# EAGLE design controller_left_upper (EAGLE 7.6.0)
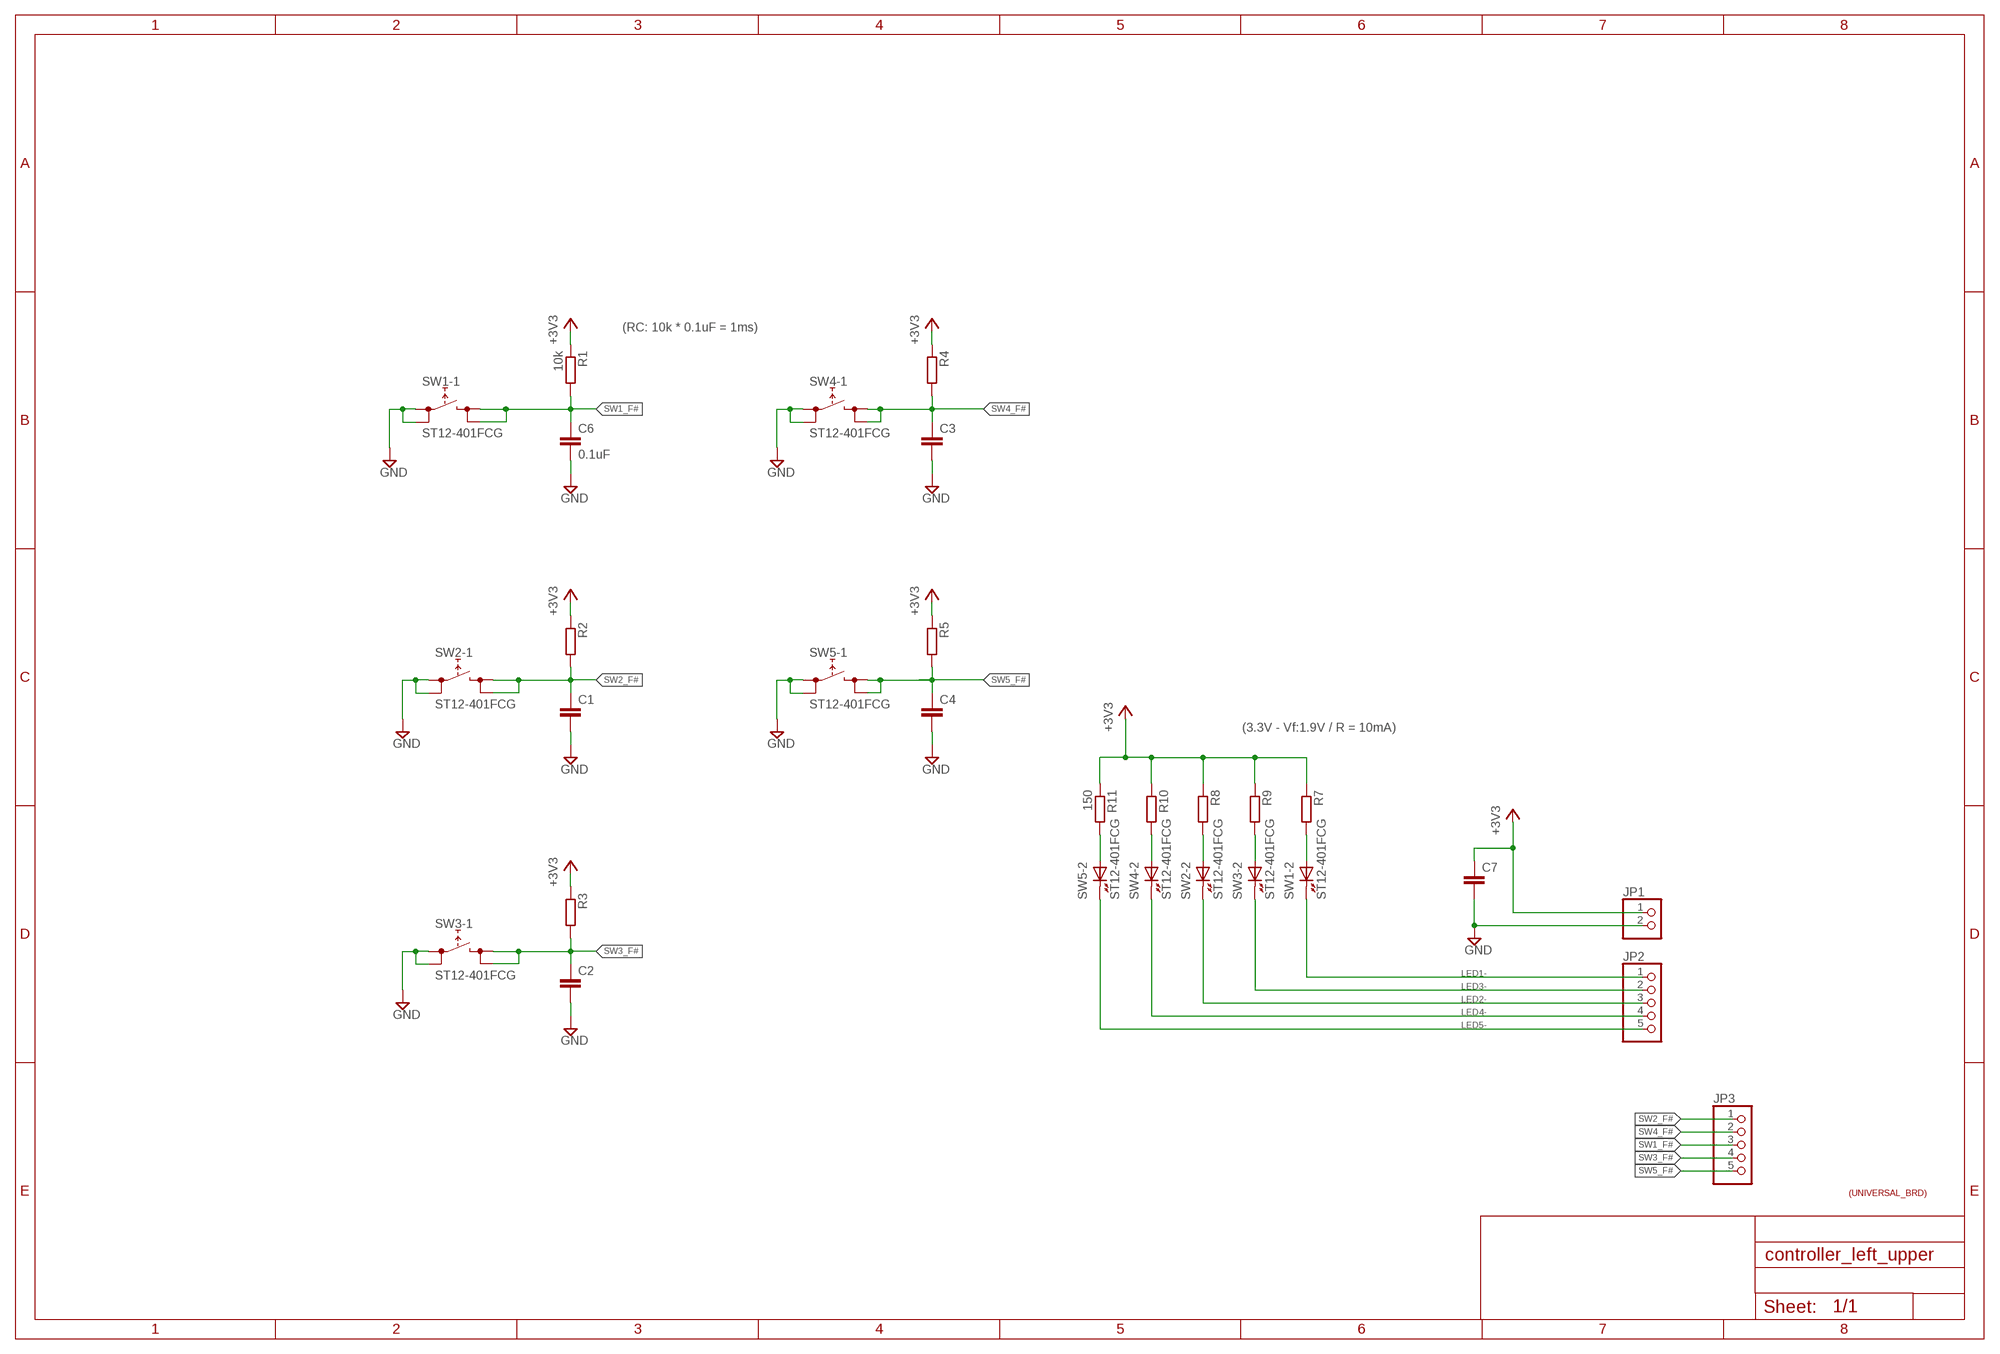
[diagram p0: schematic, sheet 1]

## Parts
C1  C_DIP_2.54_1  [C_DIP2.54_1]
C2  C_DIP_2.54_1  [C_DIP2.54_1]
C3  C_DIP_2.54_1  [C_DIP2.54_1]
C4  C_DIP_2.54_1  [C_DIP2.54_1]
C6  0.1uF  C_DIP_2.54_1  [C_DIP2.54_1]
C7  C_DIP_2.54_1  [C_DIP2.54_1]
JP1  PINHD-1X2  [1X02]
JP2  PINHD-1X5  [1X05]
JP3  PINHD-1X5  [1X05]
R1  10k  R_DIP_4  [R_DIP2.54_4]
R2  R_DIP_4  [R_DIP2.54_4]
R3  R_DIP_4  [R_DIP2.54_4]
R4  R_DIP_4  [R_DIP2.54_4]
R5  R_DIP_4  [R_DIP2.54_4]
R7  R_DIP_4  [R_DIP2.54_4]
R8  R_DIP_4  [R_DIP2.54_4]
R9  R_DIP_4  [R_DIP2.54_4]
R10  R_DIP_4  [R_DIP2.54_4]
R11  150  R_DIP_4  [R_DIP2.54_4]
SW1  ST12-401FCG  [ST12-401FCG]
SW2  ST12-401FCG  [ST12-401FCG]
SW3  ST12-401FCG  [ST12-401FCG]
SW4  ST12-401FCG  [ST12-401FCG]
SW5  ST12-401FCG  [ST12-401FCG]
U$1  UNIVERSAL_BRD_95MM_72MM  [UNIVERSAL_BRD_95MM_72MM]

## Nets
+3V3: C7.1 JP1.1 R1.1 R2.1 R3.1 R4.1 R5.1 R7.1 R8.1 R9.1 R10.1 R11.1
GND: C1.2 C2.2 C3.2 C4.2 C6.2 C7.2 JP1.2 SW1.1 SW1.2 SW2.1 SW2.2 SW3.1 SW3.2 SW4.1 SW4.2 SW5.1 SW5.2
LED1-: JP2.1 SW1.-(-2:K)
LED2-: JP2.3 SW2.-(-2:K)
LED3-: JP2.2 SW3.-(-2:K)
LED4-: JP2.4 SW4.-(-2:K)
LED5-: JP2.5 SW5.-(-2:K)
N$2: R9.2 SW3.+(-2:A)
N$7: R8.2 SW2.+(-2:A)
N$13: R10.2 SW4.+(-2:A)
N$21: R11.2 SW5.+(-2:A)
N$29: R7.2 SW1.+(-2:A)
SW1_F#: C6.1 JP3.3 R1.2 SW1.3 SW1.4
SW2_F#: C1.1 JP3.1 R2.2 SW2.3 SW2.4
SW3_F#: C2.1 JP3.4 R3.2 SW3.3 SW3.4
SW4_F#: C3.1 JP3.2 R4.2 SW4.3 SW4.4
SW5_F#: C4.1 JP3.5 R5.2 SW5.3 SW5.4

## Notes on the sheet
- (RC: 10k * 0.1uF = 1ms)
- (3.3V - Vf:1.9V / R = 10mA)

## Library data of the parts
C1-C4 C6 C7 = shozaburo_rcl:C: s means small package
JP1 = shozaburo_pinhead:PINHD-1X2: PIN HEADER
JP2 JP3 = shozaburo_pinhead:PINHD-1X5: PIN HEADER
R1-R5 R7-R11 = shozaburo_rcl:R
SW1-SW5 = shozaburo_switch:ST12-401FCG
U$1 = shozaburo_brd_template:UNIVERSAL_BRD_95MM_72MM

## Board
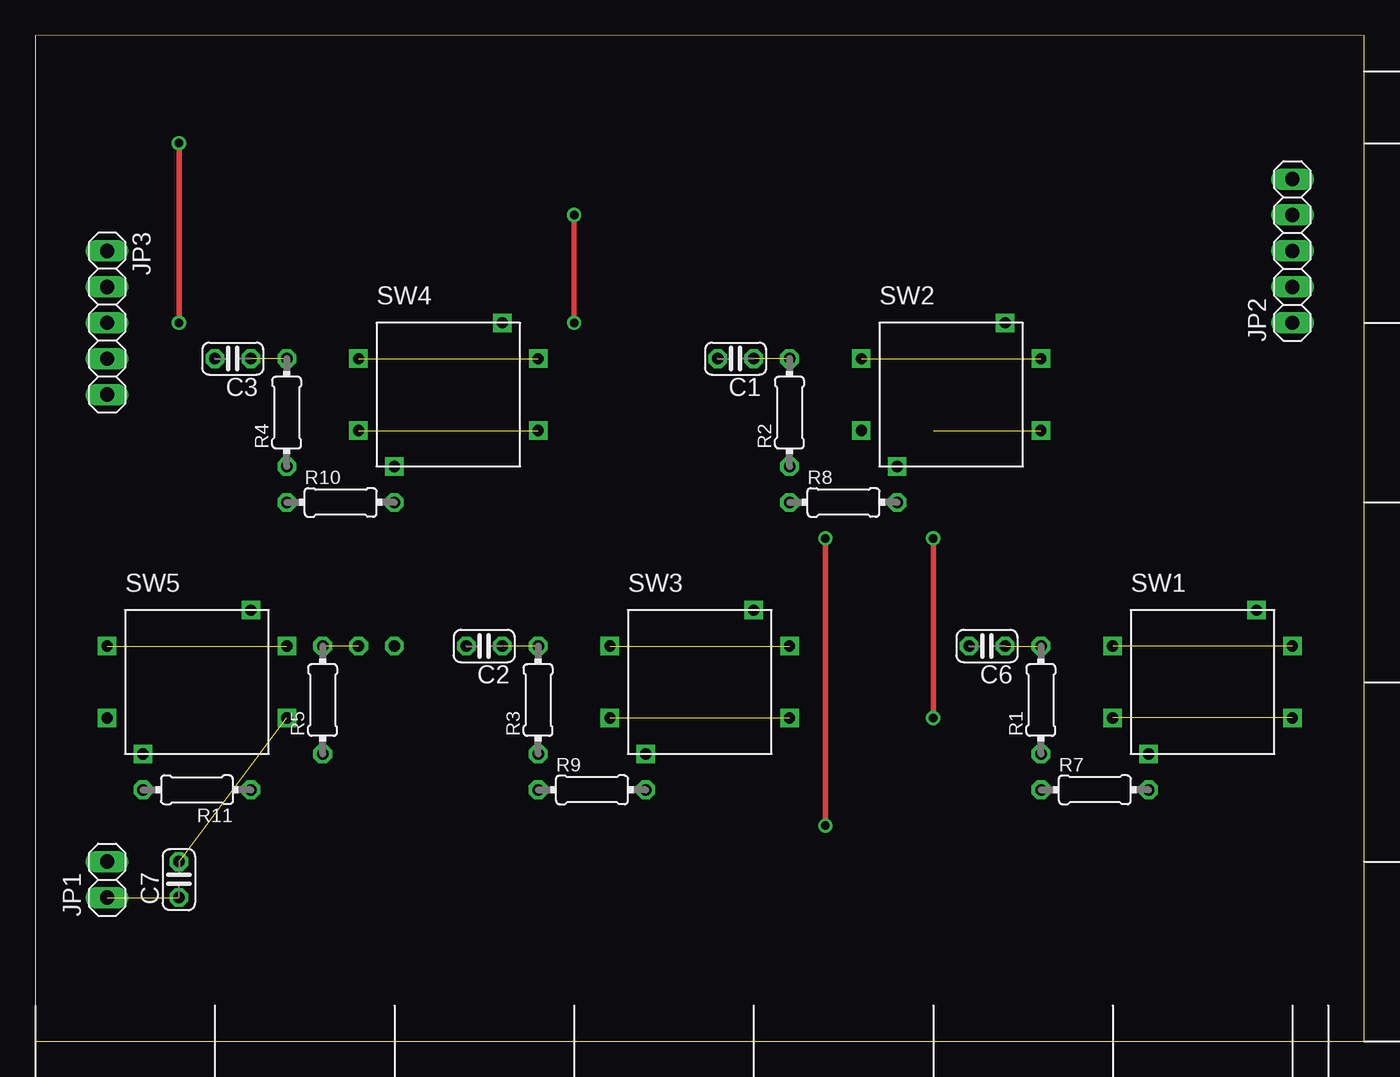
[diagram p1: board, top side]
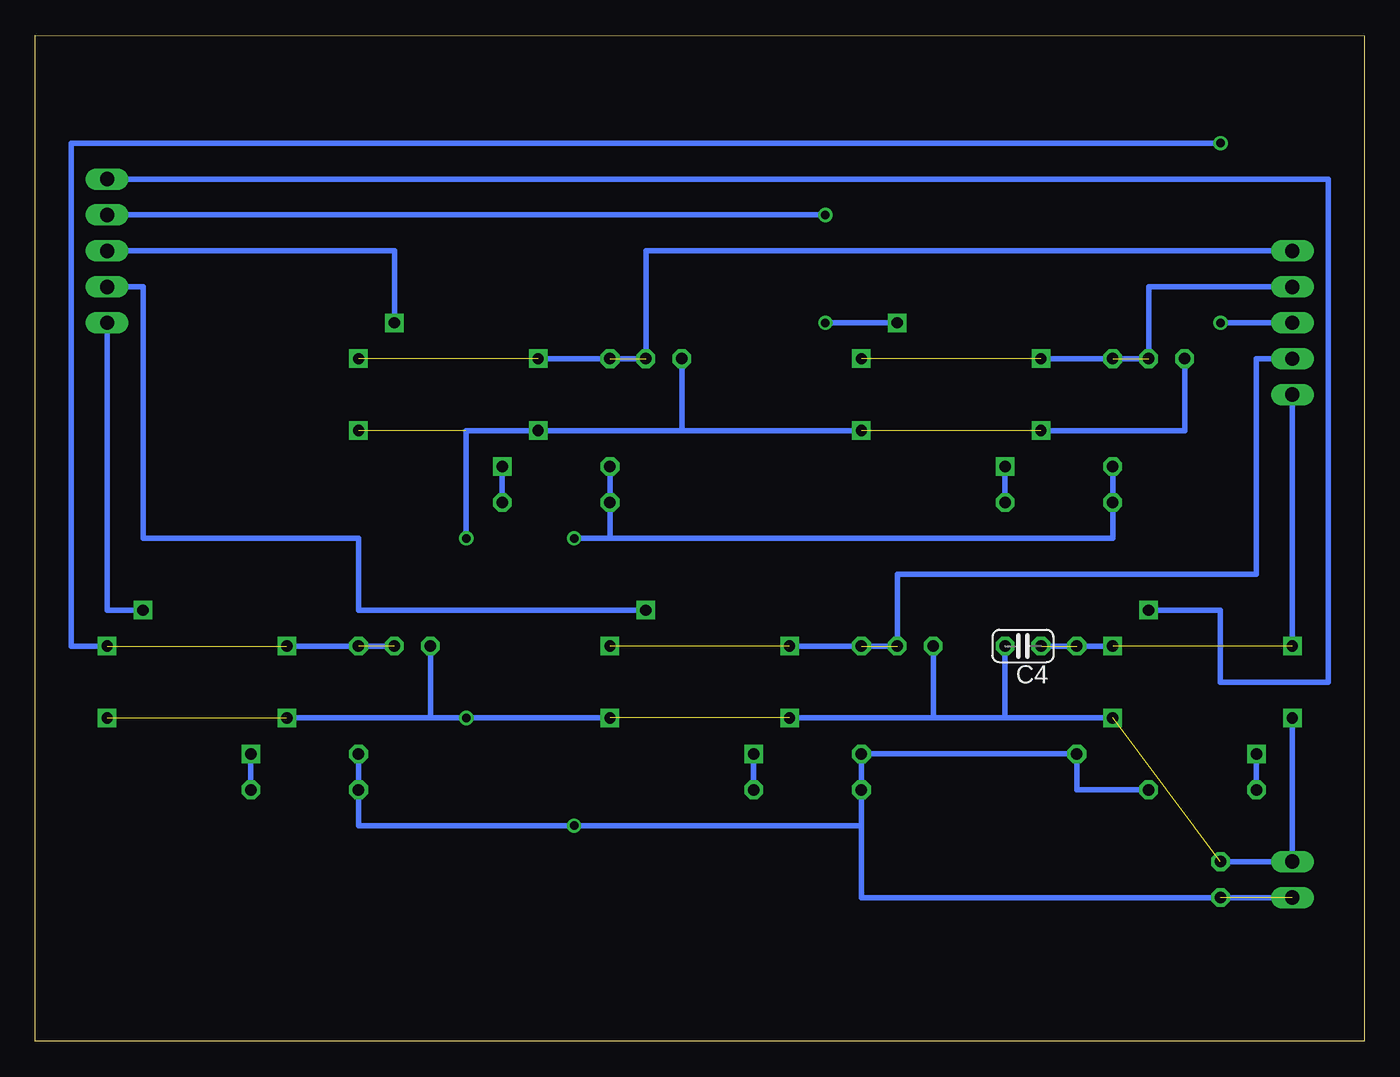
[diagram p2: board, bottom side, seen from below]

Size 93.98 x 71.12 mm. Coordinates in mm from the lower left corner, seen from the top.
Outline: 0,0 93.98,0 93.98,71.12 0,71.11 0,0
Copper layers (1*16): Top 0.035mm / dielectric 1.5mm / Bottom 0.035mm
Design rules "default": minimum track width 10mil, minimum drill 24mil, track to track 8mil, track to pad 8mil, pad to pad 8mil, via to via 8mil, smd to smd 8mil, copper to edge 40mil, drill to drill 8mil, minimum pad ring 10mil, minimum via ring 8mil, stop-mask expansion 4mil, vias tented up to drill 0mil, thermal gap 10mil

### Footprints (pad centres in the part's own frame; a part is rotated, then mirrored left to right if it is on the bottom)
C_DIP2.54_1 = drill 0.813 octagon: 1 -1.27,0; 2 1.27,0
1X02 = drill 1.016 long: 1 -1.27,0; 2 1.27,0
1X05 = drill 1.016 long: 1 -5.08,0; 2 -2.54,0; 3 0,0; 4 2.54,0; 5 5.08,0
R_DIP2.54_4 = drill 0.813 octagon: 1 -3.81,0; 2 3.81,0
ST12-401FCG = drill 0.8 square: 1 -5.08,-2.54; 2 7.62,-2.54; 3 -5.08,2.54; 4 7.62,2.54; + -2.54,-5.08; - 5.08,5.08

### Placement (x,y rotation side)
C1  49.53,48.26 180 top
C2  31.75,27.94 180 top
C3  13.97,48.26 180 top
C4  24.13,27.94 180 bottom
C6  67.31,27.94 180 top
C7  10.16,11.43 90 top
JP1  5.08,11.43 90 top
JP2  88.9,55.88 90 top
JP3  5.08,50.8 270 top
R1  71.12,24.13 90 top
R2  53.34,44.45 90 top
R3  35.56,24.13 90 top
R4  17.78,44.45 90 top
R5  20.32,24.13 90 top
R7  74.93,17.78 0 top
R8  57.15,38.1 0 top
R9  39.37,17.78 0 top
R10  21.59,38.1 0 top
R11  11.43,17.78 180 top
SW1  81.28,25.4 0 top
SW2  63.5,45.72 0 top
SW3  45.72,25.4 0 top
SW4  27.94,45.72 0 top
SW5  10.16,25.4 0 top
U$1  0,0 0 top

### Tracks (layer width: path | path; a pad name or v marks a point on that pad's centre or on a via)
+3V3  (via drill 0.6)  (1 unrouted)
  Top 0.406: v55.88,35.56 v55.88,15.24
  Bottom 0.406: R4.1 R10.1 17.78,35.56 53.34,35.56 | R2.1 R8.1 53.34,35.56 | R11.1 20.32,17.78 R5.1 R3.1 R9.1 35.56,15.24 | R7.1 R1.1 71.12,15.24 v55.88,15.24 35.56,15.24 | JP1.1 35.56,10.16 35.56,15.24 | 53.34,35.56 v55.88,35.56
GND  (via drill 0.6)  (5 unrouted)
  Top 0.406: v63.5,22.86 v63.5,35.56
  Bottom 0.406: SW4.1 12.7,43.18 C3.2 | SW3.2 v63.5,22.86 66.04,22.86 | 66.04,22.86 SW1.1 | C6.2 66.04,22.86 | v63.5,35.56 63.5,43.18 SW2.1 48.26,43.18 | SW4.2 48.26,43.18 | C1.2 48.26,43.18 | SW5.1 JP1.2 C7.2 | SW5.2 25.4,22.86 | 25.4,22.86 C4.2 | C2.2 30.48,22.86 | 30.48,22.86 SW3.1 | 25.4,22.86 30.48,22.86
LED1-
  Bottom 0.406: SW1.- 88.9,30.48 JP2.1
LED2-
  Bottom 0.406: SW2.- 68.58,55.88 JP2.3
LED3-
  Bottom 0.406: SW3.- 71.12,30.48 71.12,35.56 86.36,35.56 86.36,53.34 JP2.2
LED4-  (via drill 0.6)
  Top 0.406: v38.1,50.8 v38.1,58.42
  Bottom 0.406: SW4.- v38.1,50.8 | JP2.4 v38.1,58.42
LED5-
  Bottom 0.406: SW5.- 10.16,30.48 10.16,25.4 2.54,25.4 2.54,60.96 JP2.5
N$2
  Bottom 0.406: R9.2 SW3.+
N$7
  Bottom 0.406: SW2.+ R8.2
N$13
  Bottom 0.406: SW4.+ R10.2
N$21
  Bottom 0.406: R11.2 SW5.+
N$29
  Bottom 0.406: R7.2 SW1.+
SW1_F#  (via drill 0.6)  (2 unrouted)
  Top 0.406: v10.16,50.8 v10.16,63.5
  Bottom 0.406: SW1.3 C6.1 | JP3.3 v10.16,50.8 | v10.16,63.5 91.44,63.5 91.44,27.94 SW1.4
SW2_F#  (2 unrouted)
  Bottom 0.406: SW2.3 C1.1 50.8,55.88 JP3.1
SW3_F#  (2 unrouted)
  Bottom 0.406: SW3.3 C2.1 33.02,33.02 7.62,33.02 7.62,48.26 JP3.4
SW4_F#  (2 unrouted)
  Bottom 0.406: SW4.3 C3.1 15.24,53.34 JP3.2
SW5_F#  (2 unrouted)
  Bottom 0.406: SW5.4 C4.1 | JP3.5 SW5.3